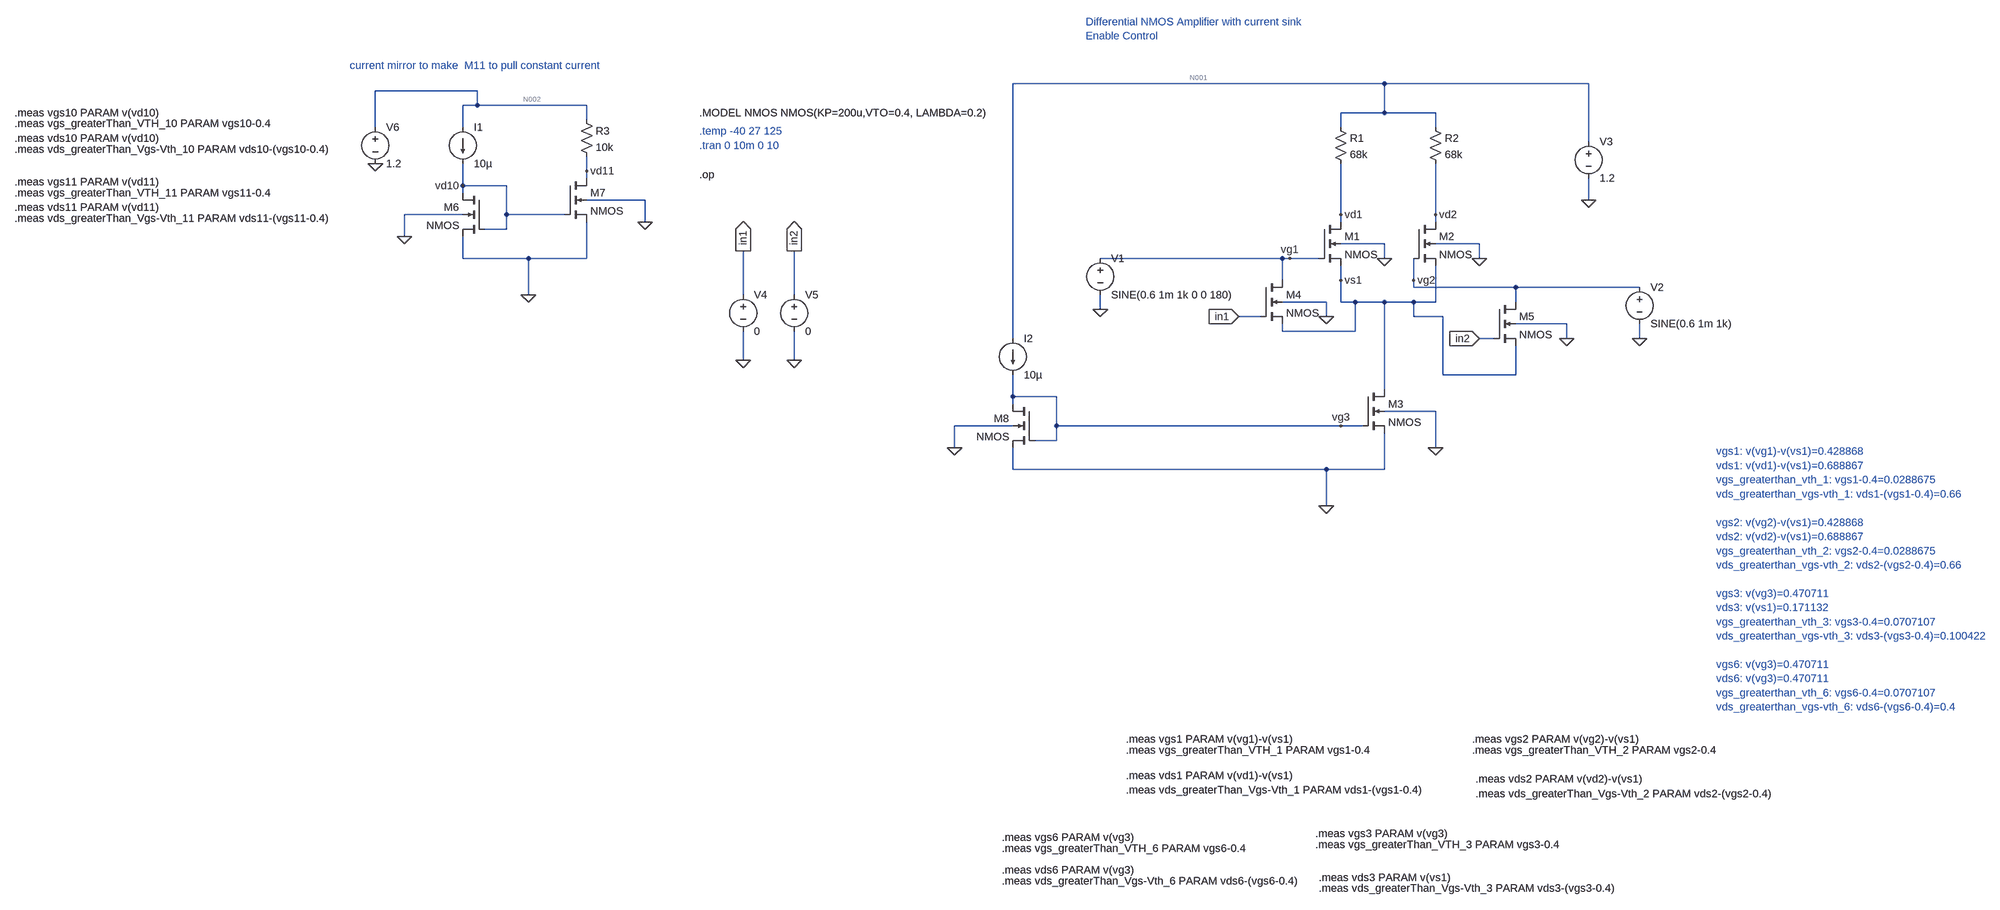
[diagram p0: schematic 4_differential_amplifier_with_current_mirror_with_lambda.asc]
4_differential_amplifier_with_current_mirror_with_lambda.asc, the LTspice schematic file:
Version 4
SHEET 1 2360 1140
WIRE 976 -800 160 -800
WIRE 1424 -800 976 -800
WIRE -1104 -784 -1328 -784
WIRE -1104 -752 -1104 -784
WIRE -1104 -752 -1136 -752
WIRE -864 -752 -1104 -752
WIRE 976 -736 976 -800
WIRE 976 -736 880 -736
WIRE 1088 -736 976 -736
WIRE -864 -720 -864 -752
WIRE -1328 -704 -1328 -784
WIRE -1136 -704 -1136 -752
WIRE 880 -704 880 -736
WIRE 1088 -704 1088 -736
WIRE 1424 -672 1424 -800
WIRE -864 -608 -864 -640
WIRE -864 -592 -864 -608
WIRE -1136 -576 -1136 -624
WIRE -1040 -576 -1136 -576
WIRE -1136 -560 -1136 -576
WIRE -736 -544 -864 -544
WIRE 1424 -544 1424 -592
WIRE -1136 -512 -1264 -512
WIRE -1040 -512 -1040 -576
WIRE -912 -512 -1040 -512
WIRE 880 -512 880 -624
WIRE 1088 -512 1088 -624
WIRE -736 -496 -736 -544
WIRE 880 -496 880 -512
WIRE 1088 -496 1088 -512
WIRE -1040 -480 -1040 -512
WIRE -1040 -480 -1088 -480
WIRE -1264 -464 -1264 -512
WIRE 976 -448 880 -448
WIRE 1184 -448 1088 -448
WIRE -1136 -416 -1136 -464
WIRE -992 -416 -1136 -416
WIRE -864 -416 -864 -496
WIRE -864 -416 -992 -416
WIRE 752 -416 352 -416
WIRE 768 -416 752 -416
WIRE 832 -416 768 -416
WIRE 976 -416 976 -448
WIRE 1184 -416 1184 -448
WIRE 752 -368 752 -416
WIRE 880 -368 880 -400
WIRE 1040 -368 1040 -416
WIRE 1040 -352 1040 -368
WIRE 1264 -352 1040 -352
WIRE 1536 -352 1264 -352
WIRE -992 -336 -992 -416
WIRE -432 -336 -432 -432
WIRE -320 -336 -320 -432
WIRE 848 -320 752 -320
WIRE 880 -320 880 -368
WIRE 912 -320 880 -320
WIRE 976 -320 912 -320
WIRE 1040 -320 976 -320
WIRE 1088 -320 1088 -400
WIRE 1088 -320 1040 -320
WIRE 1264 -320 1264 -352
WIRE 352 -304 352 -336
WIRE 704 -288 656 -288
WIRE 848 -288 848 -320
WIRE 1040 -288 1040 -320
WIRE 1104 -288 1040 -288
WIRE 1376 -272 1264 -272
WIRE 752 -256 752 -272
WIRE 912 -256 912 -320
WIRE 912 -256 752 -256
WIRE 160 -240 160 -800
WIRE 1216 -240 1184 -240
WIRE 1376 -240 1376 -272
WIRE 1536 -240 1536 -272
WIRE -432 -192 -432 -256
WIRE -320 -192 -320 -256
WIRE 1104 -160 1104 -288
WIRE 1264 -160 1264 -224
WIRE 1264 -160 1104 -160
WIRE 976 -128 976 -320
WIRE 160 -112 160 -160
WIRE 256 -112 160 -112
WIRE 160 -96 160 -112
WIRE 1088 -80 976 -80
WIRE 160 -48 32 -48
WIRE 256 -48 256 -112
WIRE 880 -48 256 -48
WIRE 928 -48 880 -48
WIRE 256 -16 256 -48
WIRE 256 -16 208 -16
WIRE 32 0 32 -48
WIRE 1088 0 1088 -80
WIRE 160 48 160 0
WIRE 848 48 160 48
WIRE 976 48 976 -32
WIRE 976 48 848 48
WIRE 848 128 848 48
FLAG 352 -304 0
FLAG 976 -416 0
FLAG 1184 -416 0
FLAG 1536 -240 0
FLAG 1424 -544 0
FLAG 768 -416 vg1
FLAG 880 -368 vs1
FLAG 880 -512 vd1
FLAG 1040 -368 vg2
FLAG 1088 -512 vd2
FLAG 880 -48 vg3
FLAG -432 -192 0
FLAG -320 -192 0
FLAG -432 -432 in1
IOPIN -432 -432 Out
FLAG -320 -432 in2
IOPIN -320 -432 Out
FLAG 1376 -240 0
FLAG 848 -288 0
FLAG 656 -288 in1
IOPIN 656 -288 In
FLAG 1184 -240 in2
IOPIN 1184 -240 In
FLAG -1264 -464 0
FLAG -736 -496 0
FLAG -1328 -624 0
FLAG -992 -336 0
FLAG -1136 -576 vd10
FLAG -864 -608 vd11
FLAG 32 0 0
FLAG 848 128 0
FLAG 1088 0 0
SYMBOL nmos4 832 -496 R0
SYMATTR InstName M1
SYMATTR Value2 l=1u w=60u
SYMBOL nmos4 1040 -496 R0
SYMATTR InstName M2
SYMATTR Value2 l=1u w=60u
SYMBOL nmos4 928 -128 R0
SYMATTR InstName M3
SYMATTR Value2 l=1u w=20u
SYMBOL voltage 352 -432 R0
WINDOW 123 0 0 Left 0
WINDOW 39 0 0 Left 0
SYMATTR InstName V1
SYMATTR Value SINE(0.6 1m 1k 0 0 180)
SYMBOL voltage 1536 -368 R0
WINDOW 123 0 0 Left 0
WINDOW 39 0 0 Left 0
SYMATTR InstName V2
SYMATTR Value SINE(0.6 1m 1k)
SYMBOL voltage 1424 -688 R0
WINDOW 123 0 0 Left 0
WINDOW 39 0 0 Left 0
SYMATTR InstName V3
SYMATTR Value 1.2
SYMBOL res 864 -720 R0
SYMATTR InstName R1
SYMATTR Value 68k
SYMBOL res 1072 -720 R0
SYMATTR InstName R2
SYMATTR Value 68k
SYMBOL voltage -432 -352 R0
WINDOW 123 0 0 Left 0
WINDOW 39 0 0 Left 0
SYMATTR InstName V4
SYMATTR Value 0
SYMBOL voltage -320 -352 R0
WINDOW 123 0 0 Left 0
WINDOW 39 0 0 Left 0
SYMATTR InstName V5
SYMATTR Value 0
SYMBOL nmos4 704 -368 R0
SYMATTR InstName M4
SYMATTR Value2 l=1u w=60u
SYMBOL nmos4 1216 -320 R0
SYMATTR InstName M5
SYMATTR Value2 l=1u w=60u
SYMBOL current -1136 -704 R0
WINDOW 123 0 0 Left 0
WINDOW 39 0 0 Left 0
SYMATTR InstName I1
SYMATTR Value 10µ
SYMBOL res -880 -736 R0
SYMATTR InstName R3
SYMATTR Value 10k
SYMBOL nmos4 -1088 -560 M0
SYMATTR InstName M6
SYMATTR Value2 l=1u w=60u
SYMBOL nmos4 -912 -592 R0
SYMATTR InstName M7
SYMATTR Value2 l=1u w=60u
SYMBOL voltage -1328 -720 R0
WINDOW 123 0 0 Left 0
WINDOW 39 0 0 Left 0
SYMATTR InstName V6
SYMATTR Value 1.2
SYMBOL current 160 -240 R0
WINDOW 123 0 0 Left 0
WINDOW 39 0 0 Left 0
SYMATTR InstName I2
SYMATTR Value 10µ
SYMBOL nmos4 208 -96 M0
SYMATTR InstName M8
SYMATTR Value2 l=1u w=20u
TEXT 320 -936 Left 2 ;Differential NMOS Amplifier with current sink\nEnable Control
TEXT -528 -736 Left 2 !.MODEL NMOS NMOS(KP=200u,VTO=0.4, LAMBDA=0.2)
TEXT -528 -664 Left 2 ;.tran 0 10m 0 10
TEXT 408 640 Left 2 !.meas vgs1 PARAM v(vg1)-v(vs1)
TEXT 408 720 Left 2 !.meas vds1 PARAM v(vd1)-v(vs1)
TEXT 408 664 Left 2 !.meas vgs_greaterThan_VTH_1 PARAM vgs1-0.4
TEXT 408 752 Left 2 !.meas vds_greaterThan_Vgs-Vth_1 PARAM vds1-(vgs1-0.4)
TEXT 1168 640 Left 2 !.meas vgs2 PARAM v(vg2)-v(vs1)
TEXT 1176 728 Left 2 !.meas vds2 PARAM v(vd2)-v(vs1)
TEXT 1168 664 Left 2 !.meas vgs_greaterThan_VTH_2 PARAM vgs2-0.4
TEXT 1176 760 Left 2 !.meas vds_greaterThan_Vgs-Vth_2 PARAM vds2-(vgs2-0.4)
TEXT 824 848 Left 2 !.meas vgs3 PARAM v(vg3)
TEXT 832 944 Left 2 !.meas vds3 PARAM v(vs1)
TEXT 824 872 Left 2 !.meas vgs_greaterThan_VTH_3 PARAM vgs3-0.4
TEXT 832 968 Left 2 !.meas vds_greaterThan_Vgs-Vth_3 PARAM vds3-(vgs3-0.4)
TEXT -528 -600 Left 2 !.op
TEXT -528 -696 Left 2 ;.temp -40 27 125
TEXT -2120 -736 Left 2 !.meas vgs10 PARAM v(vd10)
TEXT -2120 -680 Left 2 !.meas vds10 PARAM v(vd10)
TEXT -2120 -712 Left 2 !.meas vgs_greaterThan_VTH_10 PARAM vgs10-0.4
TEXT -2120 -656 Left 2 !.meas vds_greaterThan_Vgs-Vth_10 PARAM vds10-(vgs10-0.4)
TEXT -2120 -584 Left 2 !.meas vgs11 PARAM v(vd11)
TEXT -2120 -528 Left 2 !.meas vds11 PARAM v(vd11)
TEXT -2120 -560 Left 2 !.meas vgs_greaterThan_VTH_11 PARAM vgs11-0.4
TEXT -2120 -504 Left 2 !.meas vds_greaterThan_Vgs-Vth_11 PARAM vds11-(vgs11-0.4)
TEXT -1384 -840 Left 2 ;current mirror to make  M11 to pull constant current
TEXT 136 856 Left 2 !.meas vgs6 PARAM v(vg3)
TEXT 136 928 Left 2 !.meas vds6 PARAM v(vg3)
TEXT 136 880 Left 2 !.meas vgs_greaterThan_VTH_6 PARAM vgs6-0.4
TEXT 136 952 Left 2 !.meas vds_greaterThan_Vgs-Vth_6 PARAM vds6-(vgs6-0.4)
TEXT 1704 8 Left 2 ;vgs1: v(vg1)-v(vs1)=0.428868\nvds1: v(vd1)-v(vs1)=0.688867\nvgs_greaterthan_vth_1: vgs1-0.4=0.0288675\nvds_greaterthan_vgs-vth_1: vds1-(vgs1-0.4)=0.66\n \nvgs2: v(vg2)-v(vs1)=0.428868\nvds2: v(vd2)-v(vs1)=0.688867\nvgs_greaterthan_vth_2: vgs2-0.4=0.0288675\nvds_greaterthan_vgs-vth_2: vds2-(vgs2-0.4)=0.66\n \nvgs3: v(vg3)=0.470711\nvds3: v(vs1)=0.171132\nvgs_greaterthan_vth_3: vgs3-0.4=0.0707107\nvds_greaterthan_vgs-vth_3: vds3-(vgs3-0.4)=0.100422\n \nvgs6: v(vg3)=0.470711\nvds6: v(vg3)=0.470711\nvgs_greaterthan_vth_6: vgs6-0.4=0.0707107\nvds_greaterthan_vgs-vth_6: vds6-(vgs6-0.4)=0.4

The netlist it stands for:
* 4_differential_amplifier_with_current_mirror_with_lambda.asc
M1 vd1 vg1 vs1 0 NMOS l=1u w=60u
M2 vd2 vg2 vs1 0 NMOS l=1u w=60u
M3 vs1 vg3 0 0 NMOS l=1u w=20u
V1 vg1 0 SINE(0.6 1m 1k 0 0 180)
V2 vg2 0 SINE(0.6 1m 1k)
V3 N001 0 1.2
R1 N001 vd1 68k
R2 N001 vd2 68k
V4 in1 0 0
V5 in2 0 0
M4 vg1 in1 vs1 0 NMOS l=1u w=60u
M5 vg2 in2 vs1 0 NMOS l=1u w=60u
I1 N002 vd10 10µ
R3 N002 vd11 10k
M6 vd10 vd10 0 0 NMOS l=1u w=60u
M7 vd11 vd10 0 0 NMOS l=1u w=60u
V6 N002 0 1.2
I2 N001 vg3 10µ
M8 vg3 vg3 0 0 NMOS l=1u w=20u
.model NMOS NMOS
.model PMOS PMOS
.lib standard.mos
* Differential NMOS Amplifier with current sink
* Enable Control
.MODEL NMOS NMOS(KP=200u,VTO=0.4, LAMBDA=0.2)
* .tran 0 10m 0 10
.meas vgs1 PARAM v(vg1)-v(vs1)
.meas vds1 PARAM v(vd1)-v(vs1)
.meas vgs_greaterThan_VTH_1 PARAM vgs1-0.4
.meas vds_greaterThan_Vgs-Vth_1 PARAM vds1-(vgs1-0.4)
.meas vgs2 PARAM v(vg2)-v(vs1)
.meas vds2 PARAM v(vd2)-v(vs1)
.meas vgs_greaterThan_VTH_2 PARAM vgs2-0.4
.meas vds_greaterThan_Vgs-Vth_2 PARAM vds2-(vgs2-0.4)
.meas vgs3 PARAM v(vg3)
.meas vds3 PARAM v(vs1)
.meas vgs_greaterThan_VTH_3 PARAM vgs3-0.4
.meas vds_greaterThan_Vgs-Vth_3 PARAM vds3-(vgs3-0.4)
.op
* .temp -40 27 125
.meas vgs10 PARAM v(vd10)
.meas vds10 PARAM v(vd10)
.meas vgs_greaterThan_VTH_10 PARAM vgs10-0.4
.meas vds_greaterThan_Vgs-Vth_10 PARAM vds10-(vgs10-0.4)
.meas vgs11 PARAM v(vd11)
.meas vds11 PARAM v(vd11)
.meas vgs_greaterThan_VTH_11 PARAM vgs11-0.4
.meas vds_greaterThan_Vgs-Vth_11 PARAM vds11-(vgs11-0.4)
* current mirror to make  M11 to pull constant current
.meas vgs6 PARAM v(vg3)
.meas vds6 PARAM v(vg3)
.meas vgs_greaterThan_VTH_6 PARAM vgs6-0.4
.meas vds_greaterThan_Vgs-Vth_6 PARAM vds6-(vgs6-0.4)
* vgs1: v(vg1)-v(vs1)=0.428868
* vds1: v(vd1)-v(vs1)=0.688867
* vgs_greaterthan_vth_1: vgs1-0.4=0.0288675
* vds_greaterthan_vgs-vth_1: vds1-(vgs1-0.4)=0.66
* vgs2: v(vg2)-v(vs1)=0.428868
* vds2: v(vd2)-v(vs1)=0.688867
* vgs_greaterthan_vth_2: vgs2-0.4=0.0288675
* vds_greaterthan_vgs-vth_2: vds2-(vgs2-0.4)=0.66
* vgs3: v(vg3)=0.470711
* vds3: v(vs1)=0.171132
* vgs_greaterthan_vth_3: vgs3-0.4=0.0707107
* vds_greaterthan_vgs-vth_3: vds3-(vgs3-0.4)=0.100422
* vgs6: v(vg3)=0.470711
* vds6: v(vg3)=0.470711
* vgs_greaterthan_vth_6: vgs6-0.4=0.0707107
* vds_greaterthan_vgs-vth_6: vds6-(vgs6-0.4)=0.4
.backanno
.end

* Results of the author's LTspice run, read from the files saved beside the schematic
* Operating Point:
*   V(vd1) = 878.3 mV
*   V(vg1) = 600 mV
*   V(vs1) = 173.7 mV
*   V(vd2) = 878.3 mV
*   V(vg2) = 600 mV
*   V(vg3) = 467.6 mV
*   V(n001) = 1.2 V
*   V(in1) = 0 V
*   V(in2) = 0 V
*   V(n002) = 1.2 V
*   V(vd10) = 439.1 mV
*   V(vd11) = 1.088 V
*   Id(M8) = 10 µA
*   Ig(M8) = 0 A
*   Ib(M8) = -477.6 fA
*   Is(M8) = -10 µA
*   Id(M7) = 11.19 µA
*   Ig(M7) = 0 A
*   Ib(M7) = -1.098 pA
*   Is(M7) = -11.19 µA
*   Id(M6) = 10 µA
*   Ig(M6) = 0 A
*   Ib(M6) = -449.1 fA
*   Is(M6) = -10 µA
*   Id(M5) = 1.036 pA
*   Ig(M5) = 0 A
*   Ib(M5) = -793.7 fA
*   Is(M5) = -242.6 fA
*   Id(M4) = 1.036 pA
*   Ig(M4) = 0 A
*   Ib(M4) = -793.7 fA
*   Is(M4) = -242.6 fA
*   Id(M3) = 9.462 µA
*   Ig(M3) = 0 A
*   Ib(M3) = -183.7 fA
*   Is(M3) = -9.462 µA
*   Id(M2) = 4.731 µA
*   Ig(M2) = 0 A
*   Ib(M2) = -1.072 pA
*   Is(M2) = -4.731 µA
*   Id(M1) = 4.731 µA
*   Ig(M1) = 0 A
*   Ib(M1) = -1.072 pA
*   Is(M1) = -4.731 µA
*   I(I2) = 10 µA
*   I(I1) = 10 µA
*   I(R3) = 11.19 µA
*   I(R2) = 4.731 µA
*   I(R1) = 4.731 µA
*   I(V6) = -21.19 µA
*   I(V5) = 0 A
*   I(V4) = 0 A
*   I(V3) = -19.46 µA
*   I(V2) = -1.036 pA
*   I(V1) = -1.036 pA
* From the log:
*   Semiconductor Device Operating Points:
*                           --- MOSFET Transistors ---
*   Name:          m8          m7          m6          m5          m4
*   Model:        nmos        nmos        nmos        nmos        nmos
*   Id:          1.00e-05    1.12e-05    1.00e-05    1.04e-12    1.04e-12
*   Vgs:         4.68e-01    4.39e-01    4.39e-01   -1.74e-01   -1.74e-01
*   Vds:         4.68e-01    1.09e+00    4.39e-01    4.26e-01    4.26e-01
*   Vbs:         0.00e+00    0.00e+00    0.00e+00   -1.74e-01   -1.74e-01
*   Vth:         4.00e-01    4.00e-01    4.00e-01    4.00e-01    4.00e-01
*   Vdsat:       6.76e-02    3.91e-02    3.91e-02    0.00e+00    0.00e+00
*   Gm:          2.96e-04    5.72e-04    5.11e-04    0.00e+00    0.00e+00
*   Gds:         1.83e-06    1.84e-06    1.84e-06    0.00e+00    0.00e+00
*   Gmb:         0.00e+00    0.00e+00    0.00e+00    0.00e+00    0.00e+00
*   Cbd:         0.00e+00    0.00e+00    0.00e+00    0.00e+00    0.00e+00
*   Cbs:         0.00e+00    0.00e+00    0.00e+00    0.00e+00    0.00e+00
*   Cgsov:       0.00e+00    0.00e+00    0.00e+00    0.00e+00    0.00e+00
*   Cgdov:       0.00e+00    0.00e+00    0.00e+00    0.00e+00    0.00e+00
*   Cgbov:       0.00e+00    0.00e+00    0.00e+00    0.00e+00    0.00e+00
*   Cgs:         0.00e+00    0.00e+00    0.00e+00    0.00e+00    0.00e+00
*   Cgd:         0.00e+00    0.00e+00    0.00e+00    0.00e+00    0.00e+00
*   Cgb:         0.00e+00    0.00e+00    0.00e+00    0.00e+00    0.00e+00
*   Name:          m3          m2          m1
*   Model:        nmos        nmos        nmos
*   Id:          9.46e-06    4.73e-06    4.73e-06
*   Vgs:         4.68e-01    4.26e-01    4.26e-01
*   Vds:         1.74e-01    7.05e-01    7.05e-01
*   Vbs:         0.00e+00   -1.74e-01   -1.74e-01
*   Vth:         4.00e-01    4.00e-01    4.00e-01
*   Vdsat:       6.76e-02    2.63e-02    2.63e-02
*   Gm:          2.80e-04    3.60e-04    3.60e-04
*   Gds:         1.83e-06    8.29e-07    8.29e-07
*   Gmb:         0.00e+00    0.00e+00    0.00e+00
*   Cbd:         0.00e+00    0.00e+00    0.00e+00
*   Cbs:         0.00e+00    0.00e+00    0.00e+00
*   Cgsov:       0.00e+00    0.00e+00    0.00e+00
*   Cgdov:       0.00e+00    0.00e+00    0.00e+00
*   Cgbov:       0.00e+00    0.00e+00    0.00e+00
*   Cgs:         0.00e+00    0.00e+00    0.00e+00
*   Cgd:         0.00e+00    0.00e+00    0.00e+00
*   Cgb:         0.00e+00    0.00e+00    0.00e+00
*   vgs1: v(vg1)-v(vs1)=0.42629
*   vds1: v(vd1)-v(vs1)=0.704566
*   vgs_greaterthan_vth_1: vgs1-0.4=0.0262897
*   vds_greaterthan_vgs-vth_1: vds1-(vgs1-0.4)=0.678276
*   vgs2: v(vg2)-v(vs1)=0.42629
*   vds2: v(vd2)-v(vs1)=0.704566
*   vgs_greaterthan_vth_2: vgs2-0.4=0.0262897
*   vds_greaterthan_vgs-vth_2: vds2-(vgs2-0.4)=0.678276
*   vgs3: v(vg3)=0.467619
*   vds3: v(vs1)=0.17371
*   vgs_greaterthan_vth_3: vgs3-0.4=0.0676193
*   vds_greaterthan_vgs-vth_3: vds3-(vgs3-0.4)=0.106091
*   vgs10: v(vd10)=0.439142
*   vds10: v(vd10)=0.439142
*   vgs_greaterthan_vth_10: vgs10-0.4=0.0391421
*   vds_greaterthan_vgs-vth_10: vds10-(vgs10-0.4)=0.4
*   vgs11: v(vd11)=1.08807
*   vds11: v(vd11)=1.08807
*   vgs_greaterthan_vth_11: vgs11-0.4=0.688069
*   vds_greaterthan_vgs-vth_11: vds11-(vgs11-0.4)=0.4
*   vgs6: v(vg3)=0.467619
*   vds6: v(vg3)=0.467619
*   vgs_greaterthan_vth_6: vgs6-0.4=0.0676193
*   vds_greaterthan_vgs-vth_6: vds6-(vgs6-0.4)=0.4